# Altium schematic sheet spa_psu.SchDoc
size A4
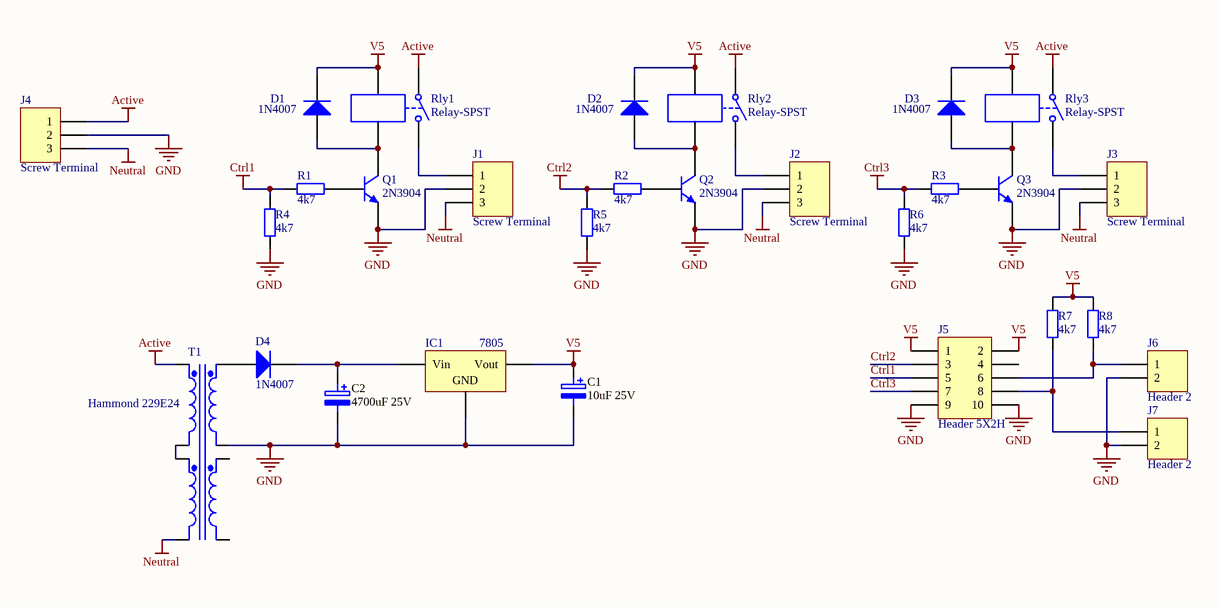
[diagram p0: spa_psu.SchDoc]

## Parts
C1  10uF 25V  [RAD-0.2]
C2  4700uF 25V  [cap_radial_600]
D1  1N4007  [DO-41]
D2  1N4007  [DO-41]
D3  1N4007  [DO-41]
D4  1N4007  [DO-41]
IC1  7805  [TO-220-AB]
J1  Screw Terminal  [Screw_Terminal_3way]
J2  Screw Terminal  [Screw_Terminal_3way]
J3  Screw Terminal  [Screw_Terminal_3way]
J4  Screw Terminal  [Screw_Terminal_3way]
J5  Header 5X2H  [HDR2X5H]
J6  Header 2  [HDR1X2_WIDE]
J7  Header 2  [HDR1X2_WIDE]
Q1  2N3904  [TO-92A]
Q2  2N3904  [TO-92A]
Q3  2N3904  [TO-92A]
R1  4k7  [AXIAL-0.4]
R2  4k7  [AXIAL-0.4]
R3  4k7  [AXIAL-0.4]
R4  4k7  [AXIAL-0.4]
R5  4k7  [AXIAL-0.4]
R6  4k7  [AXIAL-0.4]
R7  4k7  [AXIAL-0.4]
R8  4k7  [AXIAL-0.4]
Rly1  Relay-SPST  [Relay_8A]
Rly2  Relay-SPST  [Relay_8A]
Rly3  Relay-SPST  [Relay_8A]
T1  Hammond 229E24  [229E24]

## Nets
Active: J4.1 Rly1.1 Rly2.1 Rly3.1 T1.1(Pri1+)
Ctrl1: J5.5 R1.1 R4.2
Ctrl2: J5.3 R2.1 R5.2
Ctrl3: J5.7 R3.1 R6.2
GND: C1.2 C2.2 IC1.2(GND) J1.2 J2.2 J3.2 J4.2 J5.9 J5.10 J6.2 J7.2 Q1.1(E) Q2.1(E) Q3.1(E) R4.1 R5.1 R6.1 T1.6(Sec1-)
Neutral: J1.3 J2.3 J3.3 J4.3 T1.4(Pri2-)
V5: C1.1 D1.2(K) D2.2(K) D3.2(K) IC1.3(Vout) J5.1 J5.2 R7.2 R8.2 Rly1.3 Rly2.3 Rly3.3
NetC2_1: C2.1 D4.2(K) IC1.1(Vin)
NetD1_1: D1.1(A) Q1.3(C) Rly1.4
NetD2_1: D2.1(A) Q2.3(C) Rly2.4
NetD3_1: D3.1(A) Q3.3(C) Rly3.4
NetD4_1: D4.1(A) T1.5(Sec1+)
NetJ1_1: J1.1 Rly1.2
NetJ2_1: J2.1 Rly2.2
NetJ3_1: J3.1 Rly3.2
NetJ5_6: J5.6 J6.1 R8.1
NetJ5_8: J5.8 J7.1 R7.1
NetQ1_2: Q1.2(B) R1.2
NetQ2_2: Q2.2(B) R2.2
NetQ3_2: Q3.2(B) R3.2
NetT1_2: T1.2(Pri1-) T1.3(Pri2+)

Not connected (* = marked no-connect by the designer): J5 4; T1 7(Sec2+) 8(Sec2-)

## Library data of the parts
C1 C2 = ELECTRO2: Electrolytic Capacitor
D1-D4 = Diode 1N4007: 1 Amp General Purpose Rectifier; Published: 8-Jun-2000; LatestRevisionDate: 17-Jul-2002; LatestRevisionNote: Re-released for DXP Platform.; DatasheetVersion: 1998; PackageVersion: Aug-1999; PackageReference: DO-41; Publisher: Altium Limited; PackageDescription: Diode, Axial; Body 5.2 x 2.7 mm (LxDia. max), Lead Dia. 0.86 mm (max); Code_JEDEC: DO-204-AL; ComponentLink1Description: Manufacturer Link; ComponentLink1URL: http://www.fairchildsemi.com/; ComponentLink2Description: Datasheet; ComponentLink2URL: http://www.fairchildsemi.com/ds/1N%2F1N4001.pdf
IC1 = Volt Reg: Voltage Regulator; Published: 24-Mar-1999; LatestRevisionDate: 29-May-2009; LatestRevisionNote: IPC-7351 Footprint Added.; PackageReference: D2PAK; Publisher: Altium Limited; PackageDescription: 3-Pin Transistor Outline Package 2.54 mm Pitch, 15.1 mm Lead Span
J1-J4 = Header 3: Header, 3-Pin; LatestRevisionDate: 17-Jul-2002; LatestRevisionNote: Re-released for DXP Platform.; Publisher: Altium Limited
J5 = Header 5X2H: Header, 5-Pin, Dual row, Right Angle; LatestRevisionDate: 17-Jul-2002; LatestRevisionNote: Re-released for DXP Platform.; Publisher: Altium Limited
J6 J7 = Header 2: Header, 2-Pin; LatestRevisionDate: 17-Jul-2002; LatestRevisionNote: Re-released for DXP Platform.; Publisher: Altium Limited
Q1-Q3 = 2N3904: NPN General Purpose Amplifier; Published: 8-Jun-2000; LatestRevisionDate: 15-Jan-2003; LatestRevisionNote: PCB Footprint 'BCY-W3/D4.7' replaced; DatasheetVersion: 1997; PackageVersion: Sep-1998; PackageReference: TO-92A; Publisher: Altium Limited; PackageDescription: TO, Flat Index; 3 In-Line, Axial Leads; Body Dia. 4.5mm; Leads 0.51 x 0.48 mm (max); ComponentLink1Description: Manufacturer Link; ComponentLink1URL: http://www.fairchildsemi.com/; ComponentLink2Description: Datasheet; ComponentLink2URL: http://www.fairchildsemi.com/ds/2N%2F2N3904.pdf
R1-R8 = Res2: Resistor; Published: 8-Jun-2000; LatestRevisionDate: 17-Jul-2002; LatestRevisionNote: Re-released for DXP Platform.; PackageReference: AXIAL-0.4; Publisher: Altium Limited; PackageDescription: Axial Device, Thru-Hole; 2 Leads; 0.4 in Pin Spacing; Value: 4k7
Rly1-Rly3 = Relay-SPST: Single-Pole Single-Throw Relay; Published: 24-Mar-1999; LatestRevisionDate: 17-Jul-2002; LatestRevisionNote: Re-released for DXP Platform.; PackageReference: MODULE4; Publisher: Altium Limited
T1 = Trans BB: Buck-boost Transformer (Ideal); Published: 25-Jan-2001; LatestRevisionDate: 17-Jul-2002; LatestRevisionNote: Re-released for DXP Platform.; PackageReference: TRF_8; Publisher: Altium Limited